# Altium schematic sheet VALVEBOARD_DigitalInterface.SchDoc
size A4; SheetNumber: 9; SheetTotal: 9
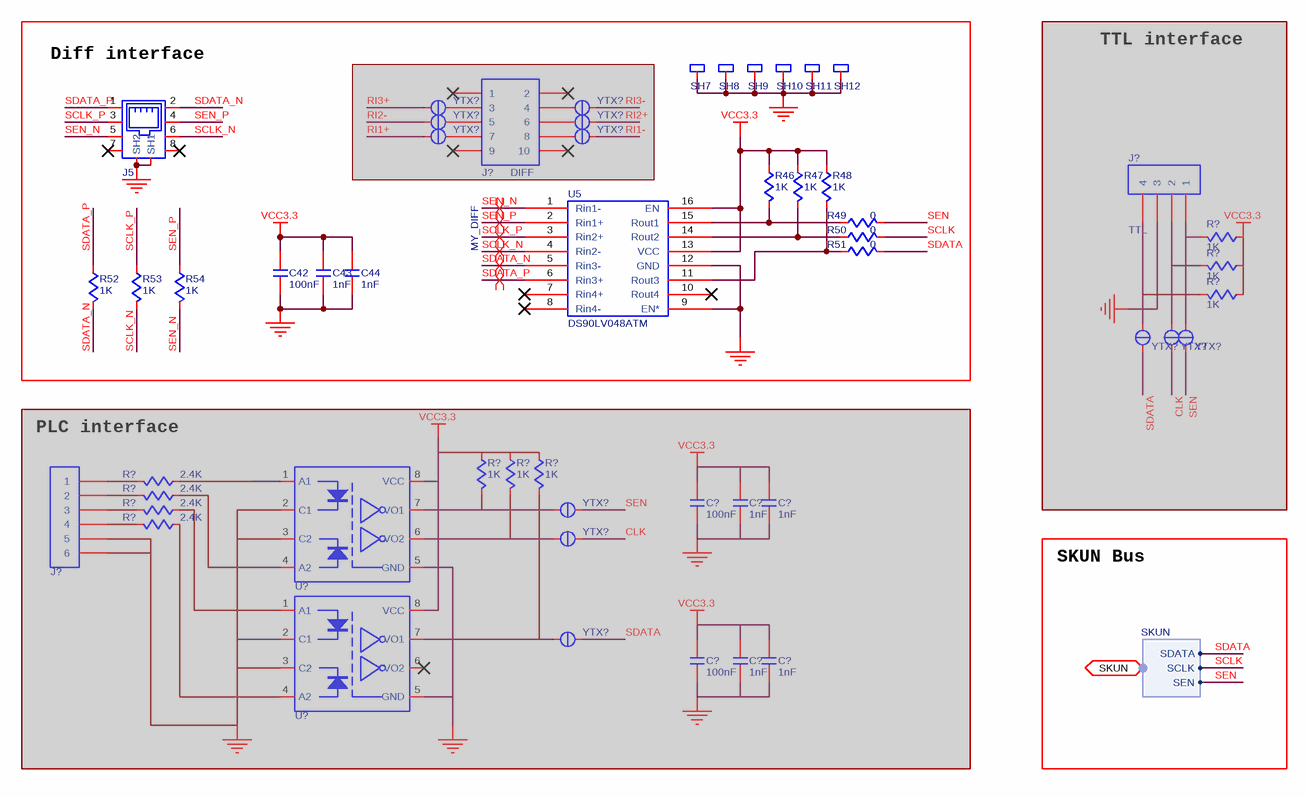
[diagram p0: VALVEBOARD_DigitalInterface.SchDoc]

## Parts
(Parts that share a designator on the sheet are numbered #1, #2 ... from top to bottom, then left to right.)
C42  value 100nF  [C0402]  (hidden comment: C-NOMO)
C43  value 1nF  [C0402]  (hidden comment: C-NOMO)
C44  value 1nF  [C0402]  (hidden comment: C-NOMO)
C?#1  value 100nF  [C0402]  (hidden comment: C-NOMO)  (masked out: inside a compile mask, not in the netlist)
C?#2  value 1nF  [C0402]  (hidden comment: C-NOMO)  (masked out: inside a compile mask, not in the netlist)
C?#3  value 1nF  [C0402]  (hidden comment: C-NOMO)  (masked out: inside a compile mask, not in the netlist)
C?#4  value 100nF  [C0402]  (hidden comment: C-NOMO)  (masked out: inside a compile mask, not in the netlist)
C?#5  value 1nF  [C0402]  (hidden comment: C-NOMO)  (masked out: inside a compile mask, not in the netlist)
C?#6  value 1nF  [C0402]  (hidden comment: C-NOMO)  (masked out: inside a compile mask, not in the netlist)
J5  GE-8  [RJ45-UP]  (value not drawn)
J?#1  DIFF  [HDR2X5-NJ]  (masked out: inside a compile mask, not in the netlist)
J?#2  TTL  [KF301-5.0-4P]  (masked out: inside a compile mask, not in the netlist)
J?#3  HDR1X6  [KF301-5.0-6P]  (value not drawn)  (masked out: inside a compile mask, not in the netlist)
R46  value 1K  [R0402]  (hidden comment: R)
R47  value 1K  [R0402]  (hidden comment: R)
R48  value 1K  [R0402]  (hidden comment: R)
R49  value 0  [R0402]  (hidden comment: R)
R50  value 0  [R0402]  (hidden comment: R)
R51  value 0  [R0402]  (hidden comment: R)
R52  value 1K  [R0402]  (hidden comment: R)
R53  value 1K  [R0402]  (hidden comment: R)
R54  value 1K  [R0402]  (hidden comment: R)
R?#1  value 1K  [R0402]  (hidden comment: R)  (masked out: inside a compile mask, not in the netlist)
R?#2  value 1K  [R0402]  (hidden comment: R)  (masked out: inside a compile mask, not in the netlist)
R?#3  value 1K  [R0402]  (hidden comment: R)  (masked out: inside a compile mask, not in the netlist)
R?#4  value 1K  [R0402]  (hidden comment: R)  (masked out: inside a compile mask, not in the netlist)
R?#5  value 1K  [R0402]  (hidden comment: R)  (masked out: inside a compile mask, not in the netlist)
R?#6  value 1K  [R0402]  (hidden comment: R)  (masked out: inside a compile mask, not in the netlist)
R?#7  value 2.4K  [R2512]  (hidden comment: R)  (masked out: inside a compile mask, not in the netlist)
R?#8  value 2.4K  [R2512]  (hidden comment: R)  (masked out: inside a compile mask, not in the netlist)
R?#9  value 2.4K  [R2512]  (hidden comment: R)  (masked out: inside a compile mask, not in the netlist)
R?#10  value 2.4K  [R2512]  (hidden comment: R)  (masked out: inside a compile mask, not in the netlist)
SH7  SHIELDSUPPORT  [SHIELDSUPPORT1]  (value not drawn)
SH8  SHIELDSUPPORT  [SHIELDSUPPORT1]  (value not drawn)
SH9  SHIELDSUPPORT  [SHIELDSUPPORT1]  (value not drawn)
SH10  SHIELDSUPPORT  [SHIELDSUPPORT1]  (value not drawn)
SH11  SHIELDSUPPORT  [SHIELDSUPPORT1]  (value not drawn)
SH12  SHIELDSUPPORT  [SHIELDSUPPORT1]  (value not drawn)
U5  DS90LV048ATM  [DS90LV048]
U?#1  TLP2168  [TLP2168]  (value not drawn)  (masked out: inside a compile mask, not in the netlist)
U?#2  TLP2168  [TLP2168]  (value not drawn)  (masked out: inside a compile mask, not in the netlist)
YTX?#1  YTX  [YTX]  (value not drawn)  (masked out: inside a compile mask, not in the netlist)
YTX?#2  YTX  [YTX]  (value not drawn)  (masked out: inside a compile mask, not in the netlist)
YTX?#3  YTX  [YTX]  (value not drawn)  (masked out: inside a compile mask, not in the netlist)
YTX?#4  YTX  [YTX]  (value not drawn)  (masked out: inside a compile mask, not in the netlist)
YTX?#5  YTX  [YTX]  (value not drawn)  (masked out: inside a compile mask, not in the netlist)
YTX?#6  YTX  [YTX]  (value not drawn)  (masked out: inside a compile mask, not in the netlist)
YTX?#7  YTX  [YTX]  (value not drawn)  (masked out: inside a compile mask, not in the netlist)
YTX?#8  YTX  [YTX]  (value not drawn)  (masked out: inside a compile mask, not in the netlist)
YTX?#9  YTX  [YTX]  (value not drawn)  (masked out: inside a compile mask, not in the netlist)
YTX?#10  YTX  [YTX]  (value not drawn)  (masked out: inside a compile mask, not in the netlist)
YTX?#11  YTX  [YTX]  (value not drawn)  (masked out: inside a compile mask, not in the netlist)
YTX?#12  YTX  [YTX]  (value not drawn)  (masked out: inside a compile mask, not in the netlist)

## Blocks framed on the sheet
Diff interface: C42-C44 J5 J?#1 R46-R54 SH7-SH12 U5 YTX?#1-YTX?#6
TTL interface: J?#2 R?#1-R?#3 YTX?#7-YTX?#9
PLC interface: C?#1-C?#6 J?#3 R?#4-R?#10 U?#1 U?#2 YTX?#10-YTX?#12

## Ports
SKUN (bidir, harness SKUN)

## Harnesses
SKUN: SDATA, SCLK, SEN

## Nets
DGND: C42.1 C43.1 C44.1 J5.SH1 J5.SH2 SH7.SH SH8.SH SH9.SH SH10.SH SH11.SH SH12.SH U5.9(EN*) U5.12(GND)
VCC3.3: C42.2 C43.2 C44.2 R46.2 R47.2 R48.2 U5.13(VCC) U5.16(EN)
SCLK: R50.1 ; port SKUN.SCLK
SCLK_N: J5.6 R53.1 U5.4(Rin2-)
SCLK_P: J5.3 R53.2 U5.3(Rin2+)
SDATA: R51.1 ; port SKUN.SDATA
SDATA_N: J5.2 R52.1 U5.5(Rin3-)
SDATA_P: J5.1 R52.2 U5.6(Rin3+)
SEN: R49.1 ; port SKUN.SEN
SEN_N: J5.5 R54.1 U5.1(Rin1-)
SEN_P: J5.4 R54.2 U5.2(Rin1+)
NetR46_1: R46.1 R49.2 U5.15(Rout1)
NetR47_1: R47.1 R50.2 U5.14(Rout2)
NetR48_1: R48.1 R51.2 U5.11(Rout3)

Not connected (* = marked no-connect by the designer): J5 7* 8*; U5 7(Rin4+)* 8(Rin4-)* 10(Rout4)*

## Layout directives
differential pair; differential pair class MY_DIFF: SCLK_N, SCLK_P, SDATA_N, SDATA_P, SEN_N, SEN_P

## Notes on the sheet
- SKUN Bus

## Library data of the parts
C42-C44 C?#1-C?#6 = C-NOMO: voltage: 25V; precision: 5%
J5 = RJ45-UP
J?#1 = HDR2X5
J?#2 = HDR1X4
R46-R54 R?#1-R?#10 = R: precision: 1%